# Altium schematic sheet Buck_Converter.SchDoc
size A; SheetNumber: 6; SheetTotal: 11
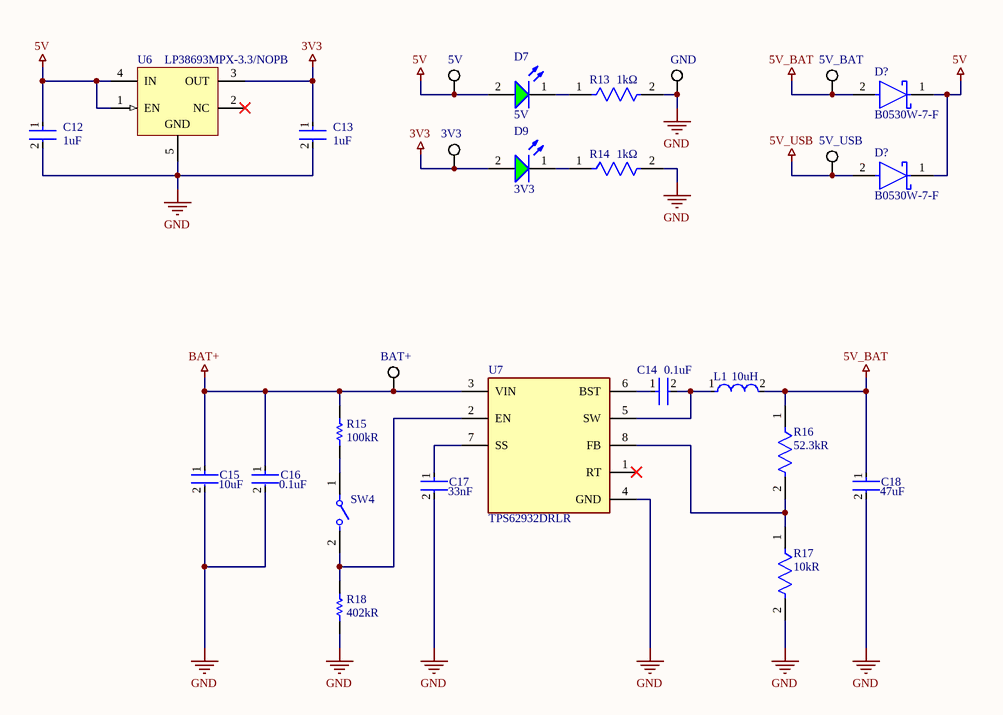
[diagram p0: Buck_Converter.SchDoc]

## Parts
(Parts that share a designator on the sheet are numbered #1, #2 ... from top to bottom, then left to right.)
3V3  (no value)  [KSTN-5019_V]
5V  (no value)  [KSTN-5019_V]
5V_BAT  (no value)  [KSTN-5019_V]
5V_USB  (no value)  [KSTN-5019_V]
BAT+  (no value)  [KSTN-5019_V]
C12  Capacitance: 1uF  [FP-CC0805-0_85-MFG]  (hidden comment: CC0805MKX7R7BB105)
C13  Capacitance: 1uF  [FP-CC0805-0_85-MFG]  (hidden comment: CC0805MKX7R7BB105)
C14  Capacitance: 0.1uF  [FP-GCD21B-0_15-IPC_B]  (hidden comment: GCD21BR71H104MA01L)
C15  Capacitance: 10uF  [FP-GRM21B-0_2-e0_2_0_7-IPC_A]  (hidden comment: GRM21BR61H106KE43L)
C16  Capacitance: 0.1uF  [FP-GCD21B-0_15-IPC_B]  (hidden comment: GCD21BR71H104MA01L)
C17  Capacitance: 33nF  [FP-C0805C-DN-MFG]  (hidden comment: C0805C333K5RACAUTO)
C18  Capacitance: 47uF  [FP-GRM21B-0_2-e0_2_0_7-IPC_A]  (hidden comment: GRM21BR61A476ME15L)
D7  5V  [WL-SMCW_0805_150080xx75000]
D9  3V3  [WL-SMCW_0805_150080xx75000]
D?#1  B0530W-7-F  [FP-SOD123-MFG]
D?#2  B0530W-7-F  [FP-SOD123-MFG]
GND  (no value)  [KSTN-5019_V]
L1  Inductance: 10uH  [FP-SRP1038A-100M-MFG]  (hidden comment: SRP1038A-100M)
R13  Resistance: 1kΩ  [FP-AF0805-IPC_A]  (hidden comment: AF0805FR-071KL)
R14  Resistance: 1kΩ  [FP-AF0805-IPC_A]  (hidden comment: AF0805FR-071KL)
R15  Resistance: 100kR  [RESC2013X60X30LL20T20]  (hidden comment: SG73S2ATTD1003F)
R16  Resistance: 52.3kR  [FP-CRCW0805-e3-IPC_A]  (hidden comment: CRCW080552K3FKEA)
R17  Resistance: 10kR  [FP-AF0805-IPC_B]  (hidden comment: AF0805FR-0710KL)
R18  Resistance: 402kR  [RESC2013X60X35NL10T20]  (hidden comment: RC0805FR-07402KL)
SW4  L101011MS02Q  [FP-L101011MS02Q-MFG]  (value not drawn)
U6  LP38693MPX-3.3/NOPB  [MP05A_M]
U7  TPS62932DRLR  [FP-DRL0008A-MFG]

## Nets
3V3: 3V3.1 C13.1 D9.2(A) U6.3(OUT)
5V: 5V.1 C12.1 D7.2(A) D?#1.1(C) D?#2.1(C) U6.1(EN) U6.4(IN)
5V_BAT: 5V_BAT.1 C18.1 D?#1.2(A) L1.2 R16.1
5V_USB: 5V_USB.1 D?#2.2(A)
BAT+: BAT+.1 C15.1 C16.1 R15.2 U7.3(VIN)
GND: C12.2 C13.2 C15.2 C16.2 C17.2 C18.2 GND.1 R13.2 R14.2 R17.2 R18.1 U6.5(GND) U7.4(GND)
NetC14_1: C14.1 U7.6(BST)
NetC14_2: C14.2 L1.1 U7.5(SW)
NetC17_1: C17.1 U7.7(SS)
NetD7_1: D7.1(K) R13.1
NetD9_1: D9.1(K) R14.1
NetR15_1: R15.1 SW4.1
NetR16_2: R16.2 R17.1 U7.8(FB)
NetR18_2: R18.2 SW4.2 U7.2(EN)

Not connected (* = marked no-connect by the designer): U6 2(NC)*; U7 1(RT)*

## Library data of the parts
3V3 5V 5V_BAT 5V_USB BAT+ GND = CMP-1672-00008-1: Test Point, 1 Position SMD, RoHS, Tape and Reel; Manufacturer: Keystone Electronics; Manufacturer Part Number: 5019; Connector Type: Interconnection Device; ComponentLink1Description: Manufacturer URL; Package Quantity: 1000; DatasheetVersion: 03/2014; Packaging: Tape and Reel; ComponentLink2URL: http://www.keyelco.com/product-pdf.cfm?p=1357; ComponentLink1URL: http://www.keyelco.com/; Mount: Surface Mount; Contact Plating: Silver; PackageDescription: 1-Pin Surface Mount Device, Body 3.81 x 2.03 mm; Pins: 1; RoHSCompliant: True; Mounting Technology: Surface Mount; ComponentLink2Description: Datasheet; PackageReference: 5019; Supplier: Digikey; Supplier Part Number: 36-5019CT-ND; RoHS: Yes; Category: Connectors; Stock: 174520; Pricing: 1=0.34, 25=0.2736, 100=0.2234, 250=0.20064, 500=0.19152 (USD); Reach SVHC Compliant: Yes; RoHS Compliant: Yes; ComponentLink3URL: https://datasheet.ciiva.com:443/pdfs/VipMasterIC/IC/KEYC/KEYC-S-A0003063693/KEYC-S-A0003063693-1.pdf?src-supplier=IHS+Markit; ComponentLink3Description: https://datasheet.ciiva.com:443/pdfs/VipMasterIC/IC/KEYC/KEYC-S-A0003063693/KEYC-S-A0003063693-1.pdf?src-supplier=IHS+Markit; ComponentLink4URL: https://datasheet.ciiva.com/16318/m60-2p61-16318395.pdf?src-supplier=Future+Electronics; ComponentLink4Description: https://datasheet.ciiva.com/16318/m60-2p61-16318395.pdf?src-supplier=Future+Electronics; ComponentLink5URL: https://datasheet.ciiva.com/14848/m60-2p61-14848438.pdf?src-supplier=Digikey; ComponentLink5Description: https://datasheet.ciiva.com/14848/m60-2p61-14848438.pdf?src-supplier=Digikey; ComponentLink6URL: https://datasheet.ciiva.com/14848/m60-2p61-14848439.pdf?src-supplier=Digikey; ComponentLink6Description: https://datasheet.ciiva.com/14848/m60-2p61-14848439.pdf?src-supplier=Digikey; ComponentLink7URL: https://datasheet.ciiva.com/14848/m60-2p61-14848437.pdf?src-supplier=Digikey; ComponentLink7Description: https://datasheet.ciiva.com/14848/m60-2p61-14848437.pdf?src-supplier=Digikey; ComponentLink8URL: https://datasheet.ciiva.com/16885/70182998-16885945.pdf?src-supplier=Allied+Electronics; ComponentLink8Description: https://datasheet.ciiva.com/16885/70182998-16885945.pdf?src-supplier=Allied+Electronics
C12 C13 = CMP-03422-001156-1: CAP CER 1UF 16V X7R 0805; Manufacturer: Yageo; Material: Ceramic; Tolerance: 0.2; Octopart: https://octopart.com/cc0805mkx7r7bb105-yageo-33242308; Footprint Url: http://www.yageo.com/exep/pages/download/literatures/UPY-C_GEN_24.pdf; Height: 0.95mm; Manufacturer Part Number: CC0805MKX7R7BB105; ComponentLink2Description: Datasheet; Device Class L2: Capacitors; Package: CC0805-0.85; RoHS: TRUE; Category: Cap; Device Class L1: Passive Components; Device Class L3: Ceramic Capacitors; Ipc Land Pattern Name: CAPC200125X85; Temperature Range Low: -30°C; ComponentLink2URL: http://www.yageo.com/documents/recent/UPY-GPHC_Y5V_6.3V-to-50V_8.pdf; Temperature: -30°C to +85°C; Automotive: No; Temperature Range High: +85°C; Mouser Description: Multilayer Ceramic Capacitors MLCC - SMD/SMT 1.0uF 16V X7R 20%; Digikey Description: CAP CER 1UF 16V X7R 0805; Voltage Rating: 16 V; Value: 1 uF; Lead Free: Yes; Temperature Characteristic: X7R
C14 C16 = CMP-06035-004518-1: Chip Multilayer Ceramic Capacitors for Automotive, 0805, 0.10uF, X7R, 15%, 20%, 50V, Grade 1
C15 = CMP-06035-004402-1: Chip Multilayer Ceramic Capacitors for General Purpose, 0805, 10uF, X5R, 15%, 10%, 50V; Voltage Rating (DC): 50V; Dielectric: X5R; Tolerance: 10%; Thickness: 1.25mm; Length: 2mm; Width: 1.25mm
C17 = CMP-2007-01069-2: CAP CER 0.033UF 50V X7R 0805; Manufacturer: KEMET; Tolerance: 0.1; Temperature Coefficient: 30ppm/°C; Value: 33,000 pF; Material: Ceramic; Temperature Characteristic: X7R; Ipc Land Pattern Name: CAPC200125X78; ComponentLink2Description: Datasheet; Temperature Range High: +125°C; Lead Free: Yes; Height: 0.88mm; Temperature: -55°C to +125°C; Voltage Rating: 50 V; Package: C0805C-DN; Mouser Description: SMD Multilayer Ceramic Capacitor, AEC-Q200 C Series, 0.033 F, 10%, X7R, 50 V, 0805 [2012 Metric]; RoHS: TRUE; Device Class L2: Capacitors; Device Class L1: Passive Components; Digikey Description: CAP CER 0.033UF 50V X7R 0805; Automotive: No; Temperature Range Low: -55°C; Category: Cap; Manufacturer Part Number: C0805C333K5RACAUTO; Device Class L3: Ceramic Capacitors; ComponentLink2URL: https://content.kemet.com/datasheets/KEM_C1003_C0G_SMD.pdf; Octopart: https://octopart.com/c0805c333k5racauto-kemet-21768584
C18 = CMP-2000-06341-2: Chip Multilayer Ceramic Capacitors for General Purpose, 0805, 47uF, X5R, 15%, 20%, 10V; Dissipation Factor: 0.035%; Length: 2mm; Voltage Rating: 10V; Mount: Surface Mount; Width: 0.049inch; Voltage Rating (DC): 10V; Lead Free: Lead Free; REACH SVHC: No SVHC; Termination: SMD/SMT; Case/Package: 0805; Dielectric: X5R; Packaging: Tape and Reel; Max Operating Temperature: 85°C; Tolerance: 20%; Thickness: 0.057inch; Dielectric Material: Ceramic; Min Operating Temperature: -55°C; Height: 1.25mm; Case Code (Imperial): 0805; Case Code (Metric): 2012; Depth: 1.25mm; Voltage: 10V
D7 = CMP-1426-00007-3: WURTH ELEKTRONIK - 150080GS75000 - LED, Green, SMD, 0805, 30 mA, 3.2 V, 520 nm; Forward Voltage: 3.2V; Viewing Angle: 140°; Power Dissipation: 105mW; Peak Wavelength: 515nm; Luminous Intensity: 450mcd; Wavelength: 525nm; Max Junction Temperature (Tj): 95°C; Forward Current: 100mA; Test Current: 20mA; Lens Style: Clear, Rectangular; Length: 2mm; Case/Package: 0805; Case Code (Metric): 2012; Color: Green; Max Reverse Voltage (DC): 5V; Height: 700µm; Width: 1.25mm; Packaging: Tape and Reel; Mount: Surface Mount; REACH SVHC: Unknown; RoHS: Compliant; Min Operating Temperature: -40°C; Reverse Voltage: 5V; Max Operating Temperature: 85°C; Dominant Wavelength: 525nm; Case Code (Imperial): 0805
D9 = CMP-1426-00007-3: WURTH ELEKTRONIK - 150080GS75000 - LED, Green, SMD, 0805, 30 mA, 3.2 V, 520 nm; Forward Voltage: 3.2V; Viewing Angle: 140°; Power Dissipation: 105mW; Peak Wavelength: 515nm; Max Reverse Voltage (DC): 5V; Luminous Intensity: 450mcd; Wavelength: 525nm; Max Junction Temperature (Tj): 95°C; Forward Current: 100mA; Test Current: 20mA; Lens Style: Clear, Rectangular; Length: 2mm; Case/Package: 0805; Case Code (Metric): 2012; Color: Green; Height: 700µm; Width: 1.25mm; Packaging: Tape and Reel; Mount: Surface Mount; REACH SVHC: Unknown; RoHS: Compliant; Min Operating Temperature: -40°C; Reverse Voltage: 5V; Max Operating Temperature: 85°C; Dominant Wavelength: 525nm; Case Code (Imperial): 0805
D?#1 D?#2 = CMP-2000-05879-2: DIODE SCHOTTKY 30V 500MA SOD123; Manufacturer: Diodes Inc.; Max Surge Forward Current: 5.5A; Forward Current: 0.5A; Max Junction Temp: +125°C; Standoff Height: 0mm; Capacitance: 170pF; Value: 170pF; Peak Reverse Current: 130uA; Footprint Url: https://www.diodes.com/assets/Package-Files/SOD123.pdf; Device Class L1: Discrete Semiconductors; ComponentLink2Description: Datasheet; Mouser Description: Schottky Diodes & Rectifiers 30V 410mW; Device Class L3: Schottky Diodes; Package: SOD123; Temperature: -65°C to +125°C; Temperature Range Low: -65°C; Lead Free: Yes; Digikey Description: DIODE SCHOTTKY 30V 500MA SOD123; Ipc Land Pattern Name: SOD365155X123-2; Automotive: No; Octopart: https://octopart.com/b0530w-7-f-diodes+inc.-325721; Device Class L2: Diodes; ComponentLink2URL: https://www.diodes.com/assets/Datasheets/ds30139.pdf; RoHS: TRUE; Height: 1.45mm; Max Repetitive Reverse Voltage: 30V; Category: Diode; Temperature Range High: +125°C; Manufacturer Part Number: B0530W-7-F; Reverse Voltage: 30V
L1 = CMP-07248-000083-1: FIXED IND 10UH 7.5A 30 MOHM SMD; Tolerance: 20%; Test Frequency: 100kHz; Self Resonant Frequency: 10MHz; Q Factor: 20; Core Material: Carbonyl Powder; Shielding: Shielded; DC Resistance (DCR): 30mR; Saturation Current: 12A; Mount: Surface Mount; Military Standard: Not; Max Operating Temperature: 150°C; Length: 11mm; Min Operating Temperature: -40°C; Ratings: AEC-Q200; Termination: SMD/SMT; RMS Current (Irms): 7.5A; Packaging: Tape and Reel; RoHS Compliant: Yes; Width: 0.394inch; Height: 3.8mm; Package Quantity: 500; DC Current: 7.5A; Case/Package: Nonstandard; Depth: 10.3mm; Max DC Current: 7.5A; Height - Seated (Max): 0.157inch; REACH SVHC: No SVHC; Resistor Type: Wirewound; Current Rating: 7.5A; Inductance Tolerance: 20%
R13 R14 = CMP-03412-043866-1: Anti-Sulfurated Chip Resistor Automotive Grade 1kΩ 1% 0.125W ±100ppm/°C 0805; Max Power Dissipation: 125mW; Number of Terminations: 2; Series: AF; Length: 0.079inch; Min Operating Temperature: -55°C; Packaging: Tape and Reel; Features: Moisture Resistant; Tolerance: 1%; Resistor Type: Thick Film; RoHS Compliant: Yes; Case/Package: 0805; Height: 0.024inch; Max Operating Temperature: 155°C; Temperature Coefficient: 100ppm/°C; Width: 0.049inch
R15 = CMP-2001-02684-1: Manufacturer: KOA Speer; Part Number: SG73S2ATTD1003F
R16 = CMP-1013-00705-3: RES Thick Film, 52.3kΩ, 1%, 0.125W, 100ppm/°C, 0805; Voltage Rating: 150V; Power Rating: 125mW; Min Operating Temperature: -55°C; Military Standard: Not; Features: Automotive AEC-Q200; Composition: Thick Film; Case/Package: 0805; Case Code (Imperial): 0805; Length: 2mm; Package Quantity: 10; Radiation Hardening: No; Max Operating Temperature: 155°C; Contact Plating: Tin; Case Code (Metric): 2012; Temperature Coefficient: 100ppm/°C; Weight: 0.000194oz; Number of Pins: 2; Number of Terminations: 2; Depth: 1.25mm; Termination: Solder; Tolerance: 1%; Max Power Dissipation: 125mW; Lead Free: Lead Free; Packaging: Tape and Reel; Width: 0.049inch; Height: 0.45mm; Voltage Rating (DC): 150V
R17 = CMP-03412-045858-1: Anti-Sulfurated Chip Resistor Automotive Grade 10kΩ 1% 0.125W ±100ppm/°C 0805; Power Rating: 125mW; Voltage Rating: 150V; Packaging: Tape and Reel; Max Operating Temperature: 155°C; Height: 0.024inch; Features: Moisture Resistant; Case Code (Imperial): 0805; Number of Terminations: 2; Series: AF; Termination: SMD/SMT; Package Quantity: 5000; Temperature Coefficient: 100ppm/°C; RoHS Compliant: Yes; Width: 1.25mm; Weight: 0.000194oz; Tolerance: 1%; Case/Package: 0805; Resistor Type: Thick Film; Max Power Dissipation: 125mW; Case Code (Metric): 2012; Length: 0.079inch; Min Operating Temperature: -55°C
R18 = CMP-2001-01136-1: Manufacturer: Yageo; Part Number: RC0805FR-07402KL
SW4 = CMP-10038-000020-1: SWITCH SLIDE SPST 4A 125V; Actuator Length: 5.08mm; Actuator Type: Standard; Contact Current Rating: 2A; Electrical Life: 10000Cycles; Switch Function: On-Off; Voltage Rating (DC): 28V; Actuator Color: Black; Actuator Material: Nylon; Switch Travel: 3.81mm; Max Voltage Rating (AC): 250V; Max Current Rating: 4A; Contact Plating: Silver; Throw Configuration: SPST; Depth: 10.8mm; Package Quantity: 1; Length: 19.1mm; Current Rating: 4A; Max Operating Temperature: 65°C; Orientation: Straight; Radiation Hardening: No; Termination: PC Pins; Max Voltage Rating (DC): 125V; Series: L; Min Operating Temperature: -30°C; Contact Material: Copper; Lead Free: Lead Free; Mount: Through Hole; RoHS Compliant: Yes; Voltage Rating (AC): 125V; Packaging: Bulk; Housing Material: Nylon
U6 = CMP-0062-02672-1: 500mA Low Dropout CMOS Linear Regulators Stable with Ceramic Output Capacitors, 5-pin SOT-223, 2000 Reel; Manufacturer: National Semiconductor; PowerWise: Y; CompType: LDO IC; PinCount: 5; Code_JEDEC: TO-261-AB; ComponentLink3URL: http://www.national.com/pf/LP/LP38693.html; RoHS: Y; ComponentLink1URL: http://www.national.com/; Code_IPC: SOT223-5; PartNumber: LP38693MPX-3.3/NOPB; DatasheetVersion: Jun-2011; High-Reliability: Y; PackageReference: MP05A; ComponentLink4URL: http://www.national.com/packaging/folders/mp05a.html; ComponentLink2Description: LP38693 Datasheet; ComponentLink4Description: MP05A Package Page; PackageDescription: Moldec SOT-223, 6.50 x 3.56 x 1.6mm Body, 5 Lead, 1.5mm Pitch; ComponentLink2URL: http://www.national.com/ds/LP/LP38691.pdf; ComponentLink1Description: Manufacturer URL; ComponentLink3Description: LP38693 Web Page; PackageVersion: revA, Jan-2000
U7 = CMP-04918-000714-1: 3.8-V TO 30-V INPUT, 2-A, 200-KH